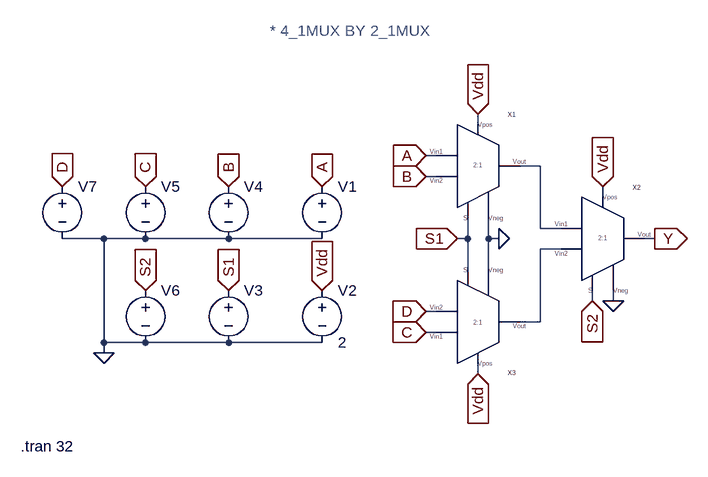
[diagram p0: schematic 4-1 MUX by 2-1 MUX.asc]
4-1 MUX by 2-1 MUX.asc, the LTspice schematic file:
Version 4
SHEET 1 880 680
WIRE 208 32 208 16
WIRE 144 80 128 80
WIRE 304 96 272 96
WIRE 144 112 128 112
WIRE 400 144 400 128
WIRE 304 192 304 96
WIRE 336 192 304 192
WIRE -368 208 -432 208
WIRE -304 208 -368 208
WIRE -176 208 -304 208
WIRE -32 208 -176 208
WIRE 192 208 192 176
WIRE 192 208 176 208
WIRE 224 208 224 176
WIRE 240 208 224 208
WIRE 480 208 464 208
WIRE 336 224 304 224
WIRE 192 256 192 208
WIRE 224 256 224 208
WIRE 384 304 384 288
WIRE 416 304 416 288
WIRE 144 320 128 320
WIRE 304 336 304 224
WIRE 304 336 272 336
WIRE 144 352 128 352
WIRE -368 368 -368 208
WIRE -304 368 -368 368
WIRE -176 368 -304 368
WIRE -32 368 -176 368
WIRE -368 384 -368 368
WIRE 208 416 208 400
FLAG -32 128 A
IOPIN -32 128 In
FLAG 128 80 A
IOPIN 128 80 In
FLAG -176 128 B
IOPIN -176 128 In
FLAG 128 112 B
IOPIN 128 112 In
FLAG -304 128 C
IOPIN -304 128 In
FLAG 128 352 C
IOPIN 128 352 In
FLAG -432 128 D
IOPIN -432 128 In
FLAG 128 320 D
IOPIN 128 320 In
FLAG 240 208 0
FLAG 416 304 0
FLAG -368 384 0
FLAG 208 16 Vdd
IOPIN 208 16 In
FLAG 400 128 Vdd
IOPIN 400 128 In
FLAG 208 416 Vdd
IOPIN 208 416 In
FLAG -32 288 Vdd
IOPIN -32 288 In
FLAG -176 288 S1
IOPIN -176 288 In
FLAG 176 208 S1
IOPIN 176 208 In
FLAG -304 288 S2
IOPIN -304 288 In
FLAG 384 304 S2
IOPIN 384 304 In
FLAG 480 208 Y
IOPIN 480 208 Out
SYMBOL 2-1mux 224 80 R0
SYMATTR InstName X1
SYMBOL 2-1mux 416 192 R0
SYMATTR InstName X2
SYMBOL 2-1mux 224 352 M180
SYMATTR InstName X3
SYMBOL voltage -32 112 R0
WINDOW 3 24 96 Invisible 2
WINDOW 123 0 0 Left 0
WINDOW 39 0 0 Left 0
SYMATTR Value PULSE(0 2 16 0.001 0.001 16 32)
SYMATTR InstName V1
SYMBOL voltage -32 272 R0
WINDOW 123 0 0 Left 0
WINDOW 39 0 0 Left 0
SYMATTR InstName V2
SYMATTR Value 2
SYMBOL voltage -176 272 R0
WINDOW 3 24 96 Invisible 2
WINDOW 123 0 0 Left 0
WINDOW 39 0 0 Left 0
SYMATTR Value PULSE(0 2 16 0.001 0.001 16 32)
SYMATTR InstName V3
SYMBOL voltage -176 112 R0
WINDOW 3 24 96 Invisible 2
WINDOW 123 0 0 Left 0
WINDOW 39 0 0 Left 0
SYMATTR Value PULSE(0 2 8 0.001 0.001 8 16)
SYMATTR InstName V4
SYMBOL voltage -304 112 R0
WINDOW 3 24 96 Invisible 2
WINDOW 123 0 0 Left 0
WINDOW 39 0 0 Left 0
SYMATTR Value PULSE(0 2 4 0.001 0.001 4 8)
SYMATTR InstName V5
SYMBOL voltage -304 272 R0
WINDOW 3 24 96 Invisible 2
WINDOW 123 0 0 Left 0
WINDOW 39 0 0 Left 0
SYMATTR Value PULSE(0 2 8 0.001 0.001 8 16)
SYMATTR InstName V6
SYMBOL voltage -432 112 R0
WINDOW 3 24 96 Invisible 2
WINDOW 123 0 0 Left 0
WINDOW 39 0 0 Left 0
SYMATTR Value PULSE(0 2 2 0.001 0.001 2 4)
SYMATTR InstName V7
TEXT -496 528 Left 2 !.tran 32
TEXT -112 -112 Left 2 ;* 4_1MUX BY 2_1MUX

The netlist it stands for:
* 4-1 MUX by 2-1 MUX.asc
XX1 A B S1 0 N001 Vdd 2-1mux  ; pins A B S gnd Y vdd
XX2 N001 N002 S2 0 Y Vdd 2-1mux  ; pins A B S gnd Y vdd
XX3 C D S1 0 N002 Vdd 2-1mux  ; pins A B S gnd Y vdd
V1 A 0 PULSE(0 2 16 0.001 0.001 16 32)
V2 Vdd 0 2
V3 S1 0 PULSE(0 2 16 0.001 0.001 16 32)
V4 B 0 PULSE(0 2 8 0.001 0.001 8 16)
V5 C 0 PULSE(0 2 4 0.001 0.001 4 8)
V6 S2 0 PULSE(0 2 8 0.001 0.001 8 16)
V7 D 0 PULSE(0 2 2 0.001 0.001 2 4)
.tran 32
* * 4_1MUX BY 2_1MUX
.backanno
.end

* Results of the author's LTspice run, read from the files saved beside the schematic
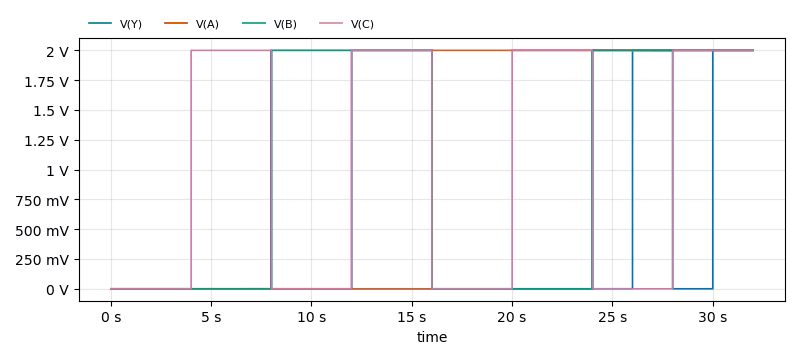
[diagram p1: Transient Analysis of 4-1 MUX by 2-1 MUX.asc, plotted from the saved traces]
* Transient Analysis, 1 run:
*   V(Y): min 0 V, max 2 V, average 500.2 mV, rms 1 V, last 2 V
*   V(A): min 0 V, max 2 V, average 1 V, rms 1.414 V, last 2 V
*   V(B): min 0 V, max 2 V, average 1 V, rms 1.414 V, last 2 V
*   V(C): min 0 V, max 2 V, average 1 V, rms 1.414 V, last 2 V